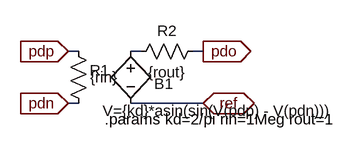
[diagram p0: schematic pdtriangle.asc]
pdtriangle.asc, the LTspice schematic file:
Version 4
SHEET 1 880 680
WIRE 128 80 112 80
WIRE 128 160 112 160
WIRE 224 80 208 80
WIRE 320 80 304 80
WIRE 320 160 208 160
FLAG 112 80 pdp
IOPIN 112 80 In
FLAG 112 160 pdn
IOPIN 112 160 In
FLAG 320 80 pdo
IOPIN 320 80 Out
FLAG 320 160 ref
IOPIN 320 160 BiDir
SYMBOL res 208 96 R270
WINDOW 0 32 56 VTop 0
WINDOW 3 0 56 VBottom 0
SYMATTR InstName R2
SYMATTR Value {rout}
SYMBOL res 112 64 R0
WINDOW 0 33 45 Left 0
WINDOW 3 34 56 Left 0
SYMATTR InstName R1
SYMATTR Value {rin}
SYMBOL bv 208 64 R0
WINDOW 0 36 66 Left 0
WINDOW 3 -43 107 Left 0
SYMATTR InstName B1
SYMATTR Value V={kd}*asin(sin(V(pdp) - V(pdn)))
TEXT 168 184 Left 0 !.params kd=2/pi rin=1Meg rout=1

The netlist it stands for:
* pdtriangle.asc
R2 N001 pdo {rout}
R1 pdp pdn {rin}
B1 N001 ref V={kd}*asin(sin(V(pdp) - V(pdn)))
.params kd=2/pi rin=1Meg rout=1
.backanno
.end